# Altium schematic sheet Sensor.SchDoc
size A2
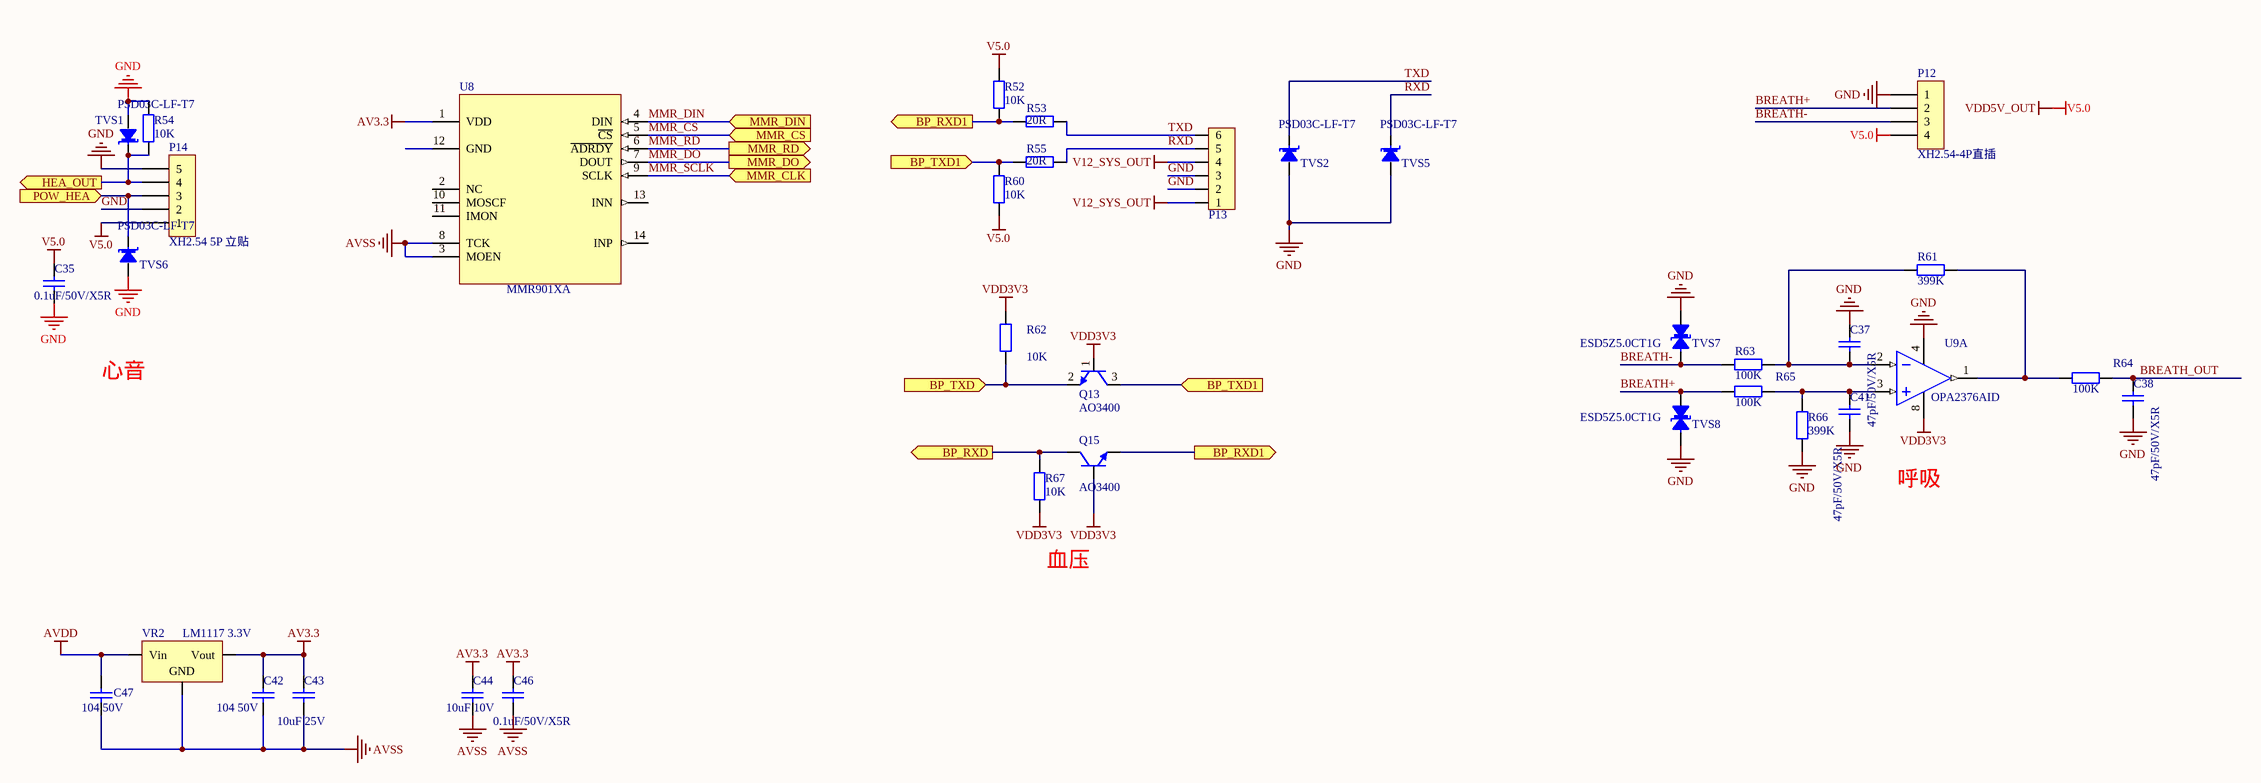
[diagram p0: Sensor.SchDoc]

## Parts
C35  0.1uF/50V/X5R  [SMD-0603C]
C37  47pF/50V/X5R  [SMD-0603C]
C38  47pF/50V/X5R  [SMD-0603C]
C41  47pF/50V/X5R  [SMD-0603C]
C42  104 50V  [SMD-0603C]
C43  10uF 25V  [SMD-0603C]
C44  10uF 10V  [SMD-0603C]
C46  0.1uF/50V/X5R  [SMD-0603C]
C47  104 50V  [SMD-0603C]
P12  XH2.54-4P直插  [4X2.54MMw]
P13  XH2.54 6P 立贴  [6X2.54MMW]  (value not drawn)
P14  XH2.54 5P 立贴  [5X2.54MMW]
Q13  AO3400  [SOT-23]
Q15  AO3400  [SOT-23]
R52  10K  [SMD-0603]
R53  20R  [SMD-0603]
R54  10K  [SMD-0603]
R55  20R  [SMD-0603]
R60  10K  [SMD-0603]
R61  399K  [SMD-0603]
R62  10K  [SMD-0603]
R63  100K  [SMD-0603]
R64  100K  [SMD-0603]
R65  100K  [SMD-0603]
R66  399K  [SMD-0603]
R67  10K  [SMD-0603]
TVS1  PSD03C-LF-T7  [SOD-323]
TVS2  PSD03C-LF-T7  [SOD-323]
TVS5  PSD03C-LF-T7  [SOD-323]
TVS6  PSD03C-LF-T7  [SOD-323]
TVS7  ESD5Z5.0CT1G  [SOD-523]
TVS8  ESD5Z5.0CT1G  [SOD-523]
U8  MMR901XA  [MMR901XA]
U9  OPA2376AID  [SOIC-8]  (part A of 2)
VR2  LM1117 3.3V  [SOT223]

## Ports
BP_RXD1 (out), BP_RXD (out), BP_TXD1 (in), BP_TXD (in), HEA_OUT (out), MMR_CLK (in), MMR_CS (in), MMR_DIN (in), MMR_DO (out), MMR_RD (out), POW_HEA (in)

## Nets
AV3.3: C42.2 C43.2 C44.2 C46.2 U8.1(VDD) VR2.2(Vout)
AVDD: C47.2 VR2.3(Vin)
AVSS: C42.1 C43.1 C44.1 C46.1 C47.1 U8.3(MOEN) U8.8(TCK) VR2.1(GND)
GND: C35.1 C37.2 C38.1 C41.1 P12.1 P13.2 P13.3 P14.2 P14.5 R54.1 R66.1 TVS1.1(A) TVS2.1(A) TVS5.1(A) TVS6.1(A) TVS7.1(A) TVS8.2(B) U9.4(V-)
V5.0: C35.2 P12.4 P14.1 R52.1 R60.2  [also labelled VDD5V_OUT]
V12_SYS_OUT: P13.1 P13.4
VDD3V3: Q13.1(B) Q15.1(B) R62.2 R67.1 U9.8(V+)
BP_RXD: Q15.3(C) R67.2 ; port BP_RXD
BP_RXD1: Q15.2(E) R52.2 R53.2 ; port BP_RXD1
BP_TXD: Q13.2(E) R62.1 ; port BP_TXD
BP_TXD1: Q13.3(C) R55.2 R60.1 ; port BP_TXD1
BREATH+: P12.2 R65.1 TVS8.1(A)
BREATH-: P12.3 R63.1 TVS7.2(B)
BREATH_OUT: C38.2 R64.2
HEA_OUT: P14.4 R54.2 TVS1.2(B) ; port HEA_OUT
MMR_CS: U8.5(~{CS}) ; port MMR_CS
MMR_DIN: U8.4(DIN) ; port MMR_DIN
MMR_DO: U8.7(DOUT) ; port MMR_DO
MMR_RD: U8.6(~{ADRDY}) ; port MMR_RD
MMR_SCLK: U8.9(SCLK) ; port MMR_CLK
POW_HEA: P14.3 TVS6.2(B) ; port POW_HEA
RXD: P13.5 R55.1 TVS5.2(B)
TXD: P13.6 R53.1 TVS2.2(B)
NetC37_1: C37.1 R61.1 R63.2 U9.2(IN1-)
NetC41_2: C41.2 R65.2 R66.2 U9.3(IN1+)
NetR61_2: R61.2 R64.1 U9.1(OUT1)

Not connected (* = marked no-connect by the designer): U8 2(NC) 10(MOSCF) 11(IMON) 12(GND) 13(INN) 14(INP)

## Notes on the sheet
- 心音
- 呼吸
- (near R67) 血压

## Library data of the parts
C35 C43 C44 = CAP4: 贴片电容 20%
C37 C38 C41 C42 C46 C47 = CAP4: 贴片电容 10%
P12 = SIP-4
P13 = SIP-6: 血压计接口
P14 = SIP-5: 心音传感器接口
Q13 Q15 = NPN-1: NPN
R52-R55 R60-R67 = R: 贴片电阻 1%
TVS1 TVS2 TVS5 TVS6 = TVS-S: 单向TVS
TVS7 TVS8 = TVS-1: ESD二极管
U8 = MMR901: 压力传感器
U9 = LM358: 运放
VR2 = LM1117: 三端稳压器